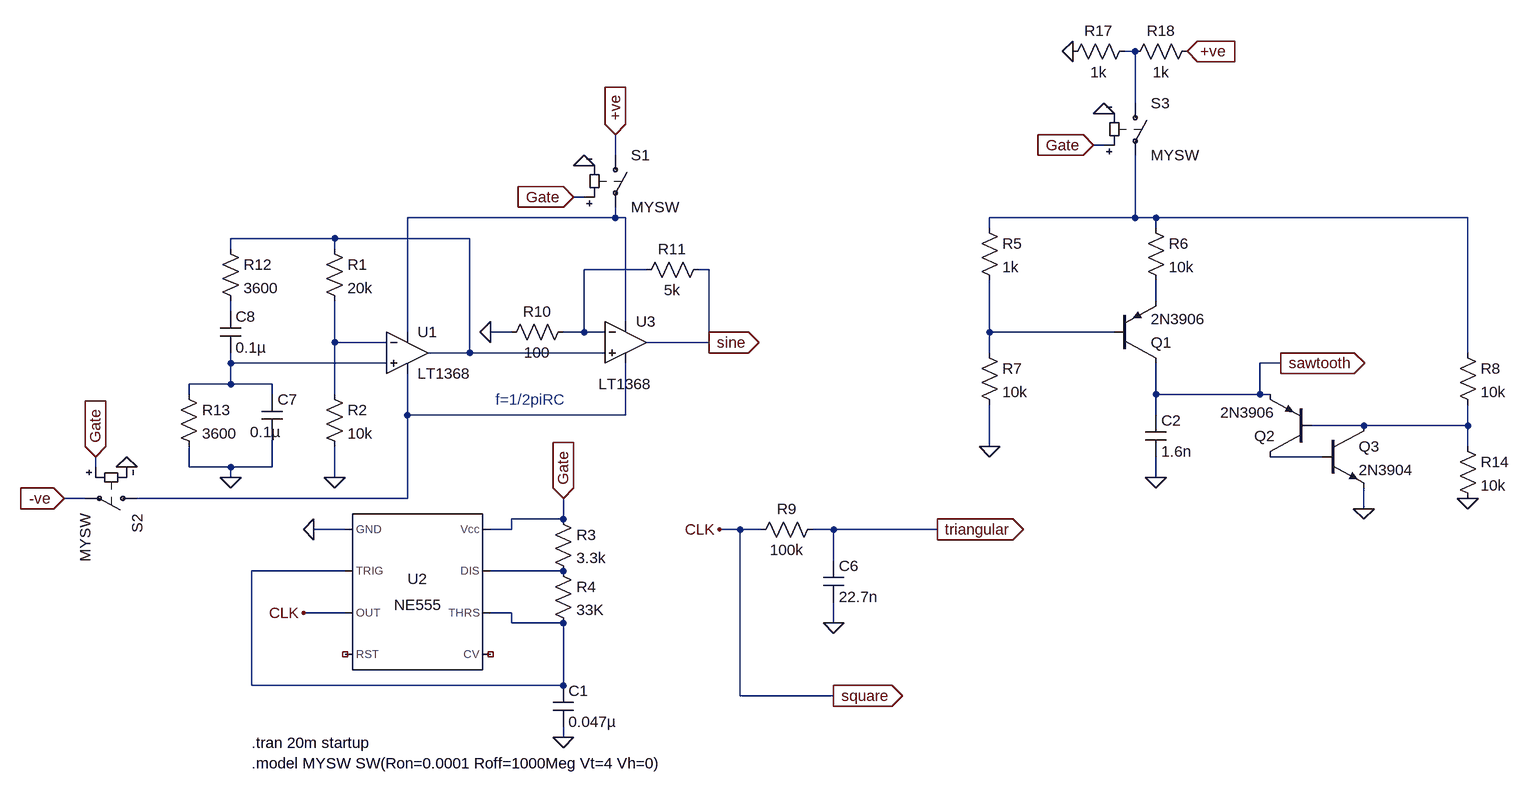
[diagram p0: schematic la.asc]
la.asc, the LTspice schematic file:
Version 4
SHEET 1 2244 1192
WIRE -816 80 -832 80
WIRE -816 160 -816 80
WIRE -864 224 -880 224
WIRE -1616 240 -1616 208
WIRE -1664 304 -1680 304
WIRE -1616 336 -1616 320
WIRE -1616 336 -1936 336
WIRE -1600 336 -1616 336
WIRE -816 336 -816 240
WIRE -816 336 -1040 336
WIRE -784 336 -816 336
WIRE -304 336 -784 336
WIRE -1040 352 -1040 336
WIRE -784 352 -784 336
WIRE -2048 368 -2208 368
WIRE -1840 368 -2048 368
WIRE -2208 384 -2208 368
WIRE -2048 384 -2048 368
WIRE -1568 416 -1664 416
WIRE -1472 416 -1488 416
WIRE -784 464 -784 432
WIRE -2208 480 -2208 464
WIRE -1600 496 -1600 336
WIRE -1936 512 -1936 336
WIRE -1776 512 -1808 512
WIRE -1664 512 -1664 416
WIRE -1664 512 -1696 512
WIRE -1632 512 -1664 512
WIRE -1040 512 -1040 432
WIRE -848 512 -1040 512
WIRE -2048 528 -2048 464
WIRE -1968 528 -2048 528
WIRE -1472 528 -1472 416
WIRE -1472 528 -1568 528
WIRE -1840 544 -1840 368
WIRE -1840 544 -1904 544
WIRE -1632 544 -1840 544
WIRE -1040 544 -1040 512
WIRE -304 544 -304 336
WIRE -2208 560 -2208 544
WIRE -1968 560 -2208 560
WIRE -592 560 -624 560
WIRE -2208 592 -2208 560
WIRE -2208 592 -2272 592
WIRE -2144 592 -2208 592
WIRE -2272 608 -2272 592
WIRE -2144 608 -2144 592
WIRE -2048 608 -2048 528
WIRE -784 608 -784 560
WIRE -624 608 -624 560
WIRE -624 608 -784 608
WIRE -608 608 -624 608
WIRE -1936 640 -1936 576
WIRE -1600 640 -1600 560
WIRE -1600 640 -1936 640
WIRE -784 640 -784 608
WIRE -464 656 -544 656
WIRE -304 656 -304 624
WIRE -304 656 -464 656
WIRE -1040 688 -1040 624
WIRE -304 688 -304 656
WIRE -528 704 -608 704
WIRE -2416 720 -2416 704
WIRE -2272 720 -2272 688
WIRE -2208 720 -2272 720
WIRE -2144 720 -2144 672
WIRE -2144 720 -2208 720
WIRE -2208 736 -2208 720
WIRE -2048 736 -2048 688
WIRE -784 736 -784 704
WIRE -2432 768 -2464 768
WIRE -1936 768 -1936 640
WIRE -1936 768 -2352 768
WIRE -464 784 -464 752
WIRE -1696 800 -1696 768
WIRE -1696 800 -1776 800
WIRE -2032 816 -2080 816
WIRE -1776 816 -1776 800
WIRE -1776 816 -1808 816
WIRE -1424 816 -1456 816
WIRE -1392 816 -1424 816
WIRE -1280 816 -1312 816
WIRE -1120 816 -1280 816
WIRE -1280 864 -1280 816
WIRE -2032 880 -2176 880
WIRE -1696 880 -1808 880
WIRE -2032 944 -2096 944
WIRE -1776 944 -1808 944
WIRE -1776 960 -1776 944
WIRE -1696 960 -1776 960
WIRE -1280 960 -1280 928
WIRE -2176 1056 -2176 880
WIRE -1696 1056 -1696 960
WIRE -1696 1056 -2176 1056
WIRE -1424 1072 -1424 816
WIRE -1280 1072 -1424 1072
WIRE -1696 1136 -1696 1120
FLAG -2048 736 0
FLAG -1472 528 sine
IOPIN -1472 528 Out
FLAG -2096 944 CLK
FLAG -2080 816 0
FLAG -592 560 sawtooth
IOPIN -592 560 Out
FLAG -1456 816 CLK
FLAG -1280 960 0
FLAG -1280 1072 square
IOPIN -1280 1072 Out
FLAG -1120 816 triangular
IOPIN -1120 816 Out
FLAG -1808 512 0
FLAG -2208 736 0
FLAG -1696 768 Gate
IOPIN -1696 768 In
FLAG -1696 1136 0
FLAG -784 736 0
FLAG -1040 688 0
FLAG -464 784 0
FLAG -304 768 0
FLAG -1616 208 +ve
IOPIN -1616 208 In
FLAG -1664 256 0
FLAG -1680 304 Gate
IOPIN -1680 304 In
FLAG -2464 768 -ve
IOPIN -2464 768 In
FLAG -2368 720 0
FLAG -2416 704 Gate
IOPIN -2416 704 In
FLAG -736 80 +ve
IOPIN -736 80 In
FLAG -912 80 0
FLAG -864 176 0
FLAG -880 224 Gate
IOPIN -880 224 In
SYMBOL res -2064 368 R0
SYMATTR InstName R1
SYMATTR Value 20k
SYMBOL res -2064 592 R0
SYMATTR InstName R2
SYMATTR Value 10k
SYMBOL Opamps\\LT1368 -1936 480 R0
SYMATTR InstName U1
SYMBOL Misc\\NE555 -1920 912 R0
SYMATTR InstName U2
SYMBOL res -1296 800 R90
WINDOW 0 0 56 VBottom 2
WINDOW 3 32 56 VTop 2
SYMATTR InstName R9
SYMATTR Value 100k
SYMBOL cap -1296 864 R0
SYMATTR InstName C6
SYMATTR Value 22.7n
SYMBOL Opamps\\LT1368 -1600 464 R0
WINDOW 3 -42 128 Left 2
SYMATTR InstName U3
SYMBOL res -1680 496 R90
WINDOW 0 0 56 VBottom 2
WINDOW 3 32 56 VTop 2
SYMATTR InstName R10
SYMATTR Value 100
SYMBOL res -1472 400 R90
WINDOW 0 0 56 VBottom 2
WINDOW 3 32 56 VTop 2
SYMATTR InstName R11
SYMATTR Value 5k
SYMBOL cap -2160 608 R0
WINDOW 3 -18 58 Left 2
SYMATTR Value 0.1µ
SYMATTR InstName C7
SYMBOL cap -2224 480 R0
SYMATTR InstName C8
SYMATTR Value 0.1µ
SYMBOL res -2224 368 R0
SYMATTR InstName R12
SYMATTR Value 3600
SYMBOL res -2288 592 R0
SYMATTR InstName R13
SYMATTR Value 3600
SYMBOL res -1712 784 R0
SYMATTR InstName R3
SYMATTR Value 3.3k
SYMBOL res -1712 864 R0
SYMATTR InstName R4
SYMATTR Value 33K
SYMBOL cap -1712 1056 R0
SYMATTR InstName C1
SYMATTR Value 0.047µ
SYMBOL res -1056 336 R0
SYMATTR InstName R5
SYMATTR Value 1k
SYMBOL res -800 336 R0
SYMATTR InstName R6
SYMATTR Value 10k
SYMBOL pnp -848 560 M180
SYMATTR InstName Q1
SYMATTR Value 2N3906
SYMBOL res -1056 528 R0
SYMATTR InstName R7
SYMATTR Value 10k
SYMBOL pnp -544 704 R180
SYMATTR InstName Q2
SYMATTR Value 2N3906
SYMBOL cap -800 640 R0
SYMATTR InstName C2
SYMATTR Value 1.6n
SYMBOL npn -528 656 R0
SYMATTR InstName Q3
SYMATTR Value 2N3904
SYMBOL res -320 528 R0
SYMATTR InstName R8
SYMATTR Value 10k
SYMBOL res -320 672 R0
SYMATTR InstName R14
SYMATTR Value 10k
SYMBOL sw -1616 224 R0
SYMATTR InstName S1
SYMATTR Value MYSW
SYMBOL sw -2336 768 R90
SYMATTR InstName S2
SYMATTR Value MYSW
SYMBOL res -816 64 R90
WINDOW 0 0 56 VBottom 2
WINDOW 3 32 56 VTop 2
SYMATTR InstName R17
SYMATTR Value 1k
SYMBOL res -720 64 R90
WINDOW 0 0 56 VBottom 2
WINDOW 3 32 56 VTop 2
SYMATTR InstName R18
SYMATTR Value 1k
SYMBOL sw -816 144 R0
SYMATTR InstName S3
SYMATTR Value MYSW
TEXT -1800 616 Left 2 ;f=1/2piRC
TEXT -2176 1144 Left 2 !.tran 20m startup
TEXT -2176 1176 Left 2 !.model MYSW SW(Ron=0.0001 Roff=1000Meg Vt=4 Vh=0)

The netlist it stands for:
* la.asc
R1 N004 N009 20k
R2 N009 0 10k
XU1 N010 N009 N002 N011 N004 LT1368  ; pins In+ In- V+ V- OUT
XU2 0 N014 square NC_01 NC_02 N014 N015 Gate NE555  ; pins GND TRIG OUT RST CV THRS DIS Vcc
R9 triangular square 100k
C6 triangular 0 22.7n
XU3 N004 N005 N002 N011 sine LT1368  ; pins In+ In- V+ V- OUT
R10 N005 0 100
R11 sine N005 5k
C7 N010 0 0.1µ
C8 N007 N010 0.1µ
R12 N004 N007 3600
R13 N010 0 3600
R3 Gate N015 3.3k
R4 N015 N014 33K
C1 N014 0 0.047µ
R5 N003 N008 1k
R6 N003 N006 10k
Q1 sawtooth N008 N006 0 2N3906
R7 N008 0 10k
Q2 N013 N012 sawtooth 0 2N3906
C2 sawtooth 0 1.6n
Q3 N012 N013 0 0 2N3904
R8 N003 N012 10k
R14 N012 0 10k
S1 +ve N002 Gate 0 MYSW
S2 N011 -ve Gate 0 MYSW
R17 N001 0 1k
R18 +ve N001 1k
S3 N001 N003 Gate 0 MYSW
.model NPN NPN
.model PNP PNP
.lib standard.bjt
* f=1/2piRC
.tran 20m startup
.model MYSW SW(Ron=0.0001 Roff=1000Meg Vt=4 Vh=0)
.lib NE555.sub
.backanno
.end